# Altium schematic sheet OMAPL-137-Manchester.SchDoc: OMAPL 137 Manchester interface
size A4; SheetNumber: 1; SheetTotal: 1; PartNumber: PNxxx; Drawn By: Sebastian Kulik; ProjectName: OMAPL 137 Manchester interface
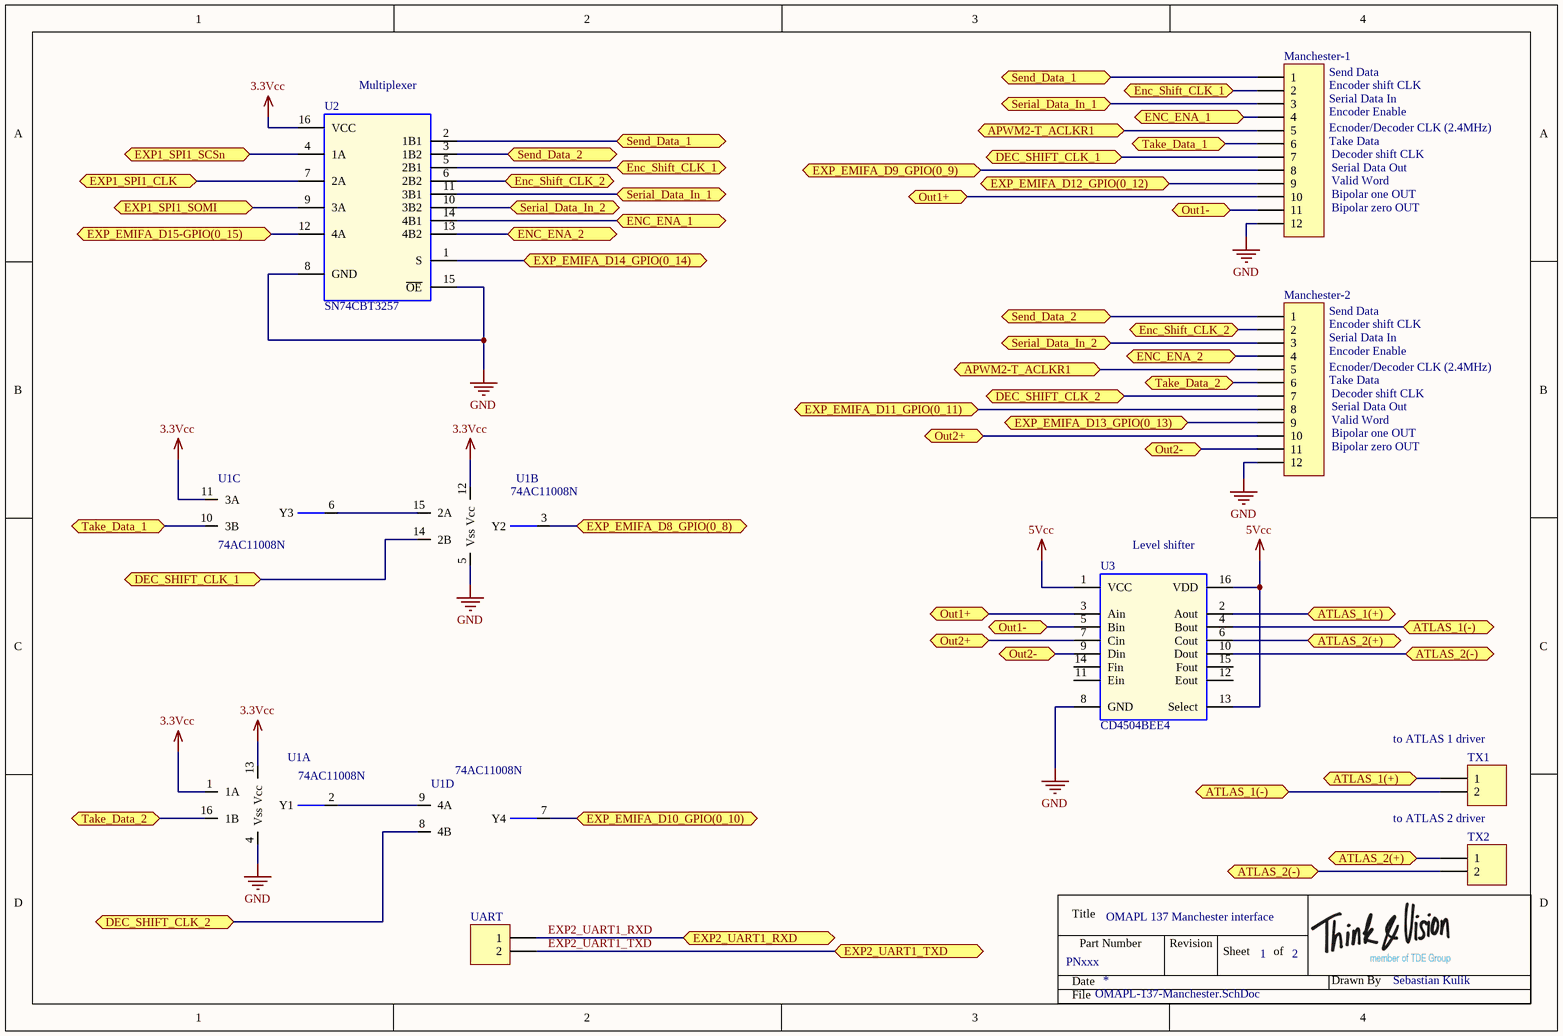
[diagram p0: OMAPL-137-Manchester.SchDoc]

## Parts
Manchester-1  Plug_12_2.54  [HDR1X12_2.54]  (value not drawn)
Manchester-2  Plug_12_2.54  [HDR1X12_2.54]  (value not drawn)
TX1  Plug_2_90_2.54  [HDR1X2]  (value not drawn)
TX2  Plug_2_90_2.54  [HDR1X2]  (value not drawn)
U1  74AC11008N  [SO-16_L]  (parts A,B,C,D of 4)
U2  SN74CBT3257  [SOIC16_N]
U3  CD4504BEE4  [DIP-16]
UART  Plug_2_90_2.54  [HDR1X2]  (value not drawn)

## Ports
APWM2-T_ACLKR1, ATLAS_1(+), ATLAS_1(-), ATLAS_2(+), ATLAS_2(-), DEC_SHIFT_CLK_1, DEC_SHIFT_CLK_2, ENC_ENA_1, ENC_ENA_2, Enc_Shift_CLK_1, Enc_Shift_CLK_2, EXP1_SPI1_CLK, EXP1_SPI1_SCSn, EXP1_SPI1_SOMI, EXP2_UART1_RXD, EXP2_UART1_TXD, EXP_EMIFA_D8_GPIO(0_8), EXP_EMIFA_D9_GPIO(0_9), EXP_EMIFA_D10_GPIO(0_10), EXP_EMIFA_D11_GPIO(0_11), EXP_EMIFA_D12_GPIO(0_12), EXP_EMIFA_D13_GPIO(0_13), EXP_EMIFA_D14_GPIO(0_14), EXP_EMIFA_D15-GPIO(0_15), Out1+, Out1-, Out2+, Out2-, Send_Data_1, Send_Data_2, Serial_Data_In_1, Serial_Data_In_2, Take_Data_1, Take_Data_2

## Nets
3.3Vcc: U1.1(1A) U1.11(3A) U1.12(Vcc) U1.13(Vcc) U2.16(VCC)
5Vcc: U3.1(VCC) U3.13(Select) U3.16(VDD)
GND: Manchester-1.12 Manchester-2.12 U1.4(Vss) U1.5(Vss) U2.8(GND) U2.15(~{OE}) U3.8(GND)
APWM2-T_ACLKR1: Manchester-1.5 Manchester-2.5 ; port APWM2-T_ACLKR1
ATLAS_1(+): TX1.1 U3.2(Aout) ; port ATLAS_1(+)
ATLAS_1(-): TX1.2 U3.4(Bout) ; port ATLAS_1(-)
ATLAS_2(+): TX2.1 U3.6(Cout) ; port ATLAS_2(+)
ATLAS_2(-): TX2.2 U3.10(Dout) ; port ATLAS_2(-)
DEC_SHIFT_CLK_1: Manchester-1.7 U1.14(2B) ; port DEC_SHIFT_CLK_1
DEC_SHIFT_CLK_2: Manchester-2.7 U1.8(4B) ; port DEC_SHIFT_CLK_2
ENC_ENA_1: Manchester-1.4 U2.14(4B1) ; port ENC_ENA_1
ENC_ENA_2: Manchester-2.4 U2.13(4B2) ; port ENC_ENA_2
Enc_Shift_CLK_1: Manchester-1.2 U2.5(2B1) ; port Enc_Shift_CLK_1
Enc_Shift_CLK_2: Manchester-2.2 U2.6(2B2) ; port Enc_Shift_CLK_2
EXP1_SPI1_CLK: U2.7(2A) ; port EXP1_SPI1_CLK
EXP1_SPI1_SCSn: U2.4(1A) ; port EXP1_SPI1_SCSn
EXP1_SPI1_SOMI: U2.9(3A) ; port EXP1_SPI1_SOMI
EXP2_UART1_RXD: UART.1 ; port EXP2_UART1_RXD
EXP2_UART1_TXD: UART.2 ; port EXP2_UART1_TXD
EXP_EMIFA_D8_GPIO(0_8): U1.3(Y2) ; port EXP_EMIFA_D8_GPIO(0_8)
EXP_EMIFA_D9_GPIO(0_9): Manchester-1.8 ; port EXP_EMIFA_D9_GPIO(0_9)
EXP_EMIFA_D10_GPIO(0_10): U1.7(Y4) ; port EXP_EMIFA_D10_GPIO(0_10)
EXP_EMIFA_D11_GPIO(0_11): Manchester-2.8 ; port EXP_EMIFA_D11_GPIO(0_11)
EXP_EMIFA_D12_GPIO(0_12): Manchester-1.9 ; port EXP_EMIFA_D12_GPIO(0_12)
EXP_EMIFA_D13_GPIO(0_13): Manchester-2.9 ; port EXP_EMIFA_D13_GPIO(0_13)
EXP_EMIFA_D14_GPIO(0_14): U2.1(S) ; port EXP_EMIFA_D14_GPIO(0_14)
EXP_EMIFA_D15-GPIO(0_15): U2.12(4A) ; port EXP_EMIFA_D15-GPIO(0_15)
Out1+: Manchester-1.10 U3.3(Ain) ; port Out1+
Out1-: Manchester-1.11 U3.5(Bin) ; port Out1-
Out2+: Manchester-2.10 U3.7(Cin) ; port Out2+
Out2-: Manchester-2.11 U3.9(Din) ; port Out2-
Send_Data_1: Manchester-1.1 U2.2(1B1) ; port Send_Data_1
Send_Data_2: Manchester-2.1 U2.3(1B2) ; port Send_Data_2
Serial_Data_In_1: Manchester-1.3 U2.11(3B1) ; port Serial_Data_In_1
Serial_Data_In_2: Manchester-2.3 U2.10(3B2) ; port Serial_Data_In_2
Take_Data_1: Manchester-1.6 U1.10(3B) ; port Take_Data_1
Take_Data_2: Manchester-2.6 U1.16(1B) ; port Take_Data_2
NetU1_2: U1.2(Y1) U1.9(4A)
NetU1_6: U1.6(Y3) U1.15(2A)

Not connected (* = marked no-connect by the designer): U3 11(Ein) 12(Eout) 14(Fin) 15(Fout)

## Notes on the sheet
- (near U2) Multiplexer
- (near Manchester-1) Send Data
- (near Manchester-1) Encoder shift CLK
- (near Manchester-1) Serial Data In
- (near Manchester-1) Encoder Enable
- (near Manchester-1) Ecnoder/Decoder CLK (2.4MHz)
- (near Manchester-1) Take Data
- (near Manchester-1) Decoder shift CLK
- (near Manchester-1) Serial Data Out
- (near Manchester-1) Valid Word
- (near Manchester-1) Bipolar one OUT
- (near Manchester-1) Bipolar zero OUT
- (near Manchester-2) Send Data
- (near Manchester-2) Ecnoder/Decoder CLK (2.4MHz)
- (near Manchester-2) Encoder shift CLK
- (near Manchester-2) Serial Data In
- (near Manchester-2) Encoder Enable
- (near Manchester-2) Take Data
- (near Manchester-2) Decoder shift CLK
- (near Manchester-2) Serial Data Out
- (near Manchester-2) Valid Word
- (near Manchester-2) Bipolar one OUT
- (near Manchester-2) Bipolar zero OUT
- (near U3) Level shifter
- (near TX1) to ATLAS 1 driver
- to ATLAS 2 driver
- 1
- 2
- Title
- Date
- Part Number
- Revision
- Sheet
- of
- Drawn By
- File

## Library data of the parts
Manchester-1 Manchester-2 = Plug_12_2.54: Plug, 11-Pin; Manufacturer PartNr: 61301211121; Manufacturer: WE; TDE-PN: CON0018; LatestRevisionDate: 27.05.2014; LatestRevisionNote: Re-released for DXP Platform.; Publisher: Sebastian Kulik; Deliverer: WE; Deliverer PartNr: 61301211121
TX1 TX2 UART = Plug_2_90_2.54: Plug, 2-Pin; Manufacturer PartNr: 61300211021; Manufacturer: WE; Deliverer PartNr: 2356176; Deliverer: Farnell; TDE-PN: CON0010; LatestRevisionDate: 14.05.2014; LatestRevisionNote: Re-released for DXP Platform.; Publisher: Sebastian Kulik
U1 = 74AC11008N: Quad AND, TTL; Deliverer PartNr: 1749860; Manufacturer: TI; Deliverer: Farnell; TDE-PN: IC0083; Published: 16.08.2016; PackageDescription: SOIC16; Publisher: Sebastian Kulik; Manufacturer PartNr: 74AC11008N; Price: 1.45
U2 = SN74CBT3257: LV 4BIT FET MUX/DEMUX; Deliverer PartNr: 1740177; Manufacturer PartNr: SN74CBTLV3257D; Manufacturer: TI; Deliverer: Farnell; TDE-PN: IC00082; Published: 16.08.2016; PackageDescription: SOP16; Publisher: Sebastian Kulik; Price: 0.977/1
U3 = CD4504BEE4: 20V Level shifter; Deliverer PartNr: 709-2545; Manufacturer: TI; Deliverer: RS; TDE-PN: IC00084; Published: 16.08.2016; PackageDescription: DIP16; Publisher: Sebastian Kulik; Manufacturer PartNr: CD4504BEE4; Price: 0.204/10